# EAGLE design eoncontrol (EAGLE 9.6.2)
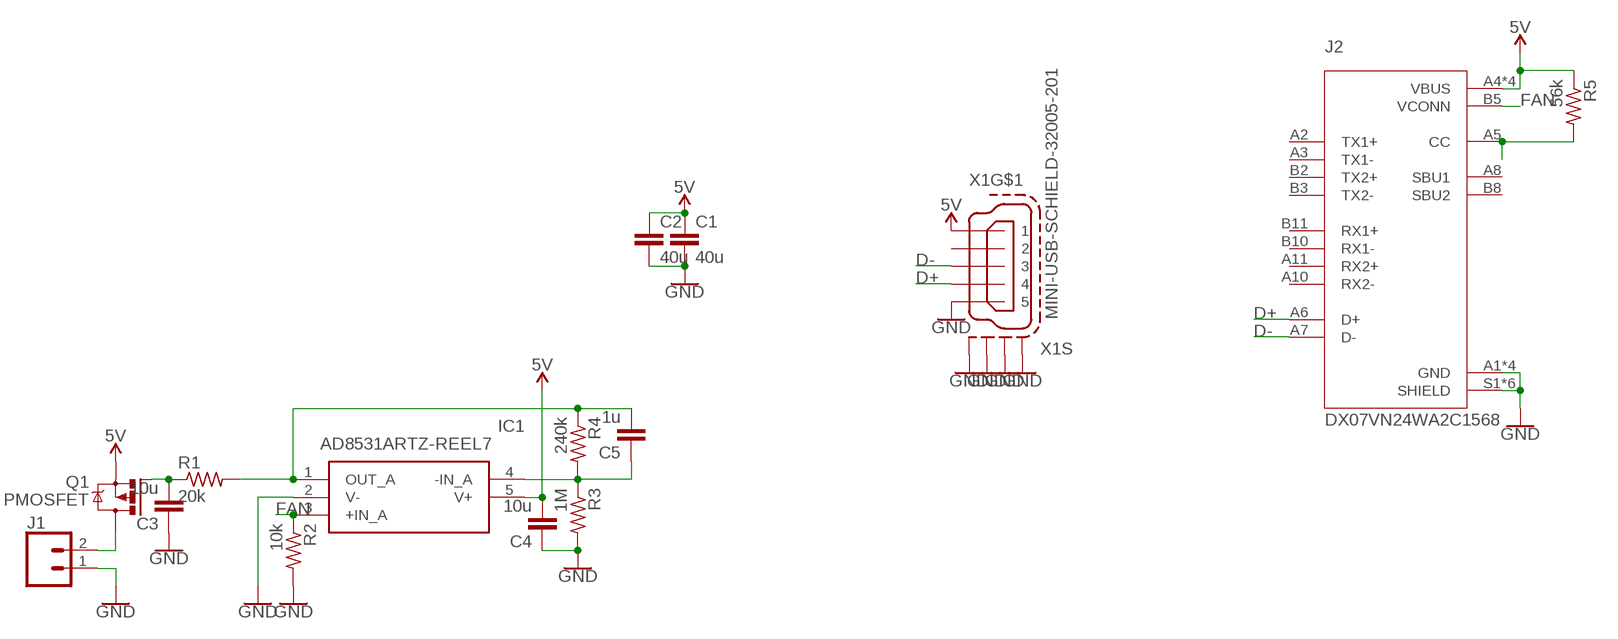
[diagram p0: schematic, sheet 1]

## Parts
C1  40u  C-EUC1206  [C1206]
C2  40u  C-EUC1206  [C1206]
C3  10u  C0603  [0603-C]
C4  10u  C0603  [0603-C]
C5  1u  C0603  [0603-C]
IC1  AD8531ARTZ-REEL7  [SOT95P280X145-5N]
J1  CONN_02  [1X02]
J2  DX07VN24WA2C1568  [JAE_DX07VN24WA2C1568]
Q1  PMOSFET  PMOSFET_SOT23  [SOT23]
R1  20k  R0603  [0603-R]
R2  10k  R0603  [0603-R]
R3  1M  R0603  [0603-R]
R4  240k  R0603  [0603-R]
R5  56k  R0603  [0603-R]
X1  MINI-USB-SCHIELD-32005-201  [32005-201]

## Nets
5V: C1.1 C2.1 C4.2 IC1.5(V+) J2.A4(VBUS) J2.A9(VBUS) J2.B4(VBUS) J2.B9(VBUS) Q1.2(S) R5.1 X1.1
D+: J2.A6(D+) X1.4
D-: J2.A7(D-) X1.3
FAN: IC1.3(+IN_A) J2.B5(VCONN) R2.1
GND: C1.2 C2.2 C3.1 C4.1 IC1.2(V-) J1.1 J2.A1(GND) J2.A12(GND) J2.B1(GND) J2.B12(GND) J2.S1(SHIELD) J2.S2(SHIELD) J2.S3(SHIELD) J2.S4(SHIELD) J2.S5(SHIELD) J2.S6(SHIELD) R2.2 R3.2 X1.5 X1.M1(S:S1) X1.M2(S:S2) X1.M3(S:S3) X1.M4(S:S4)
N$1: C3.2 Q1.1(G) R1.1
N$2: J1.2 Q1.3(D)
N$3: C5.1 IC1.4(-IN_A) R3.1 R4.2
N$4: C5.2 IC1.1(OUT_A) R1.2 R4.1
N$5: J2.A5(CC) R5.2
Unconnected: J2.A2(TX1+) J2.A3(TX1-) J2.A8(SBU1) J2.A10(RX2-) J2.A11(RX2+) J2.B2(TX2+) J2.B3(TX2-) J2.B8(SBU2) J2.B10(RX1-) J2.B11(RX1+) X1.2

## Library data of the parts
C1 C2 = rcl:C-EU: CAPACITOR, European symbol; SPICEPREFIX: C
C3-C5 = comma.ai:C
IC1 = SamacSys_Parts:AD8531ARTZ-REEL7: Low Cost, 250 mA Output, Single-Supply Amplifiers Source: Datasheet; DESCRIPTION: Low Cost, 250 mA Output, Single-Supply Amplifiers; HEIGHT: 1.45mm; MANUFACTURER_NAME: Analog Devices; MANUFACTURER_PART_NUMBER: AD8531ARTZ-REEL7; MOUSER_PART_NUMBER: 584-AD8531ARTZ-R7; MOUSER_PRICE-STOCK: https://www.mouser.co.uk/ProductDetail/Analog-Devices/AD8531ARTZ-REEL7?qs=%2FtpEQrCGXCznF5XgXexEPw%3D%3D
J1 = SparkFun-Connectors:CONN_02: Multi connection point. Often used as Generic Header-pin footprint for 0.1 inch spaced/style header connections On any of the 0.1 inch spaced packages, you can populate with these: Break Away Headers - Straight <https://www.sparkfun.com/products/116> (PRT-00116) Break Away Male Headers - Right Angle <https://www.sparkfun.com/products/553> (PRT-00553) Female Headers <https://www.sparkfun.com/products/115> (PRT-00115) Break Away Headers - Machine Pin <https://www.sparkfun.com/products/117> (PRT-00117) Break Away Female Headers - Swiss Machine Pin <https://www.sparkfun.com/products/743> (PRT-00743) For SCREWTERMINALS and SPRING TERMINALS visit here: Screw Terimnals on SparkFun.com <https://www.sparkfun.com/search/results?term=Screw+Terminals> (5mm/3.5mm/2.54mm spacing) This device is also useful as a general connection point to wire up your design to another part of your project. Our various solder wires solder well into these plated through hole pads. Hook-Up Wire - Assortment (Stranded, 22 AWG) <https://www.sparkfun.com/products/11375> (PRT-11375) Hook-Up Wire - Assortment (Solid Core, 22 AWG) <https://www.sparkfun.com/products/11367> (PRT-11367) View the entire wire category on our website here <https://www.sparkfun.com/categories/141> Special notes: Molex polarized connector foot print use with: PRT-08233 with associated crimp pins and housings. 2.54_SCREWTERM for use with PRT-10571. 3.5mm Screw Terminal footprints for PRT-08084 5mm Screw Terminal footprints for use with PRT-08432
J2 = DX07VN24WA2C1568:DX07VN24WA2C1568: CONN PLUG USB3.1 TYPEC 24POS SMD Check prices <https://pricing.snapeda.com/parts/DX07VN24WA2C1568/JAE%20Electronics/view-part?ref=eda>; AVAILABILITY: Warning; DESCRIPTION: USB-C (USB TYPE-C) USB 3.2 Gen 2 (USB 3.1 Gen 2, Superspeed + (USB 3.1)) Plug Connector 24 Position Surface Mount; MF: JAE Electronics; MP: DX07VN24WA2C1568; PACKAGE: None; PRICE: None; PURCHASE-URL: https://pricing.snapeda.com/search/part/DX07VN24WA2C1568/?ref=eda
Q1 = Transistor:PMOSFET: P-Channel MOSFET - Generic; CATEGORY: Transistor; SUB-CATEGORY: MOSFET; TYPE: P-Channel
R1-R5 = comma.ai:R
X1 = con-cypressindustries:MINI-USB-SCHIELD-: MINI USB-B Conector Source: www.cypressindustries.com; OC_FARNELL: unknown; OC_NEWARK: unknown

## Board
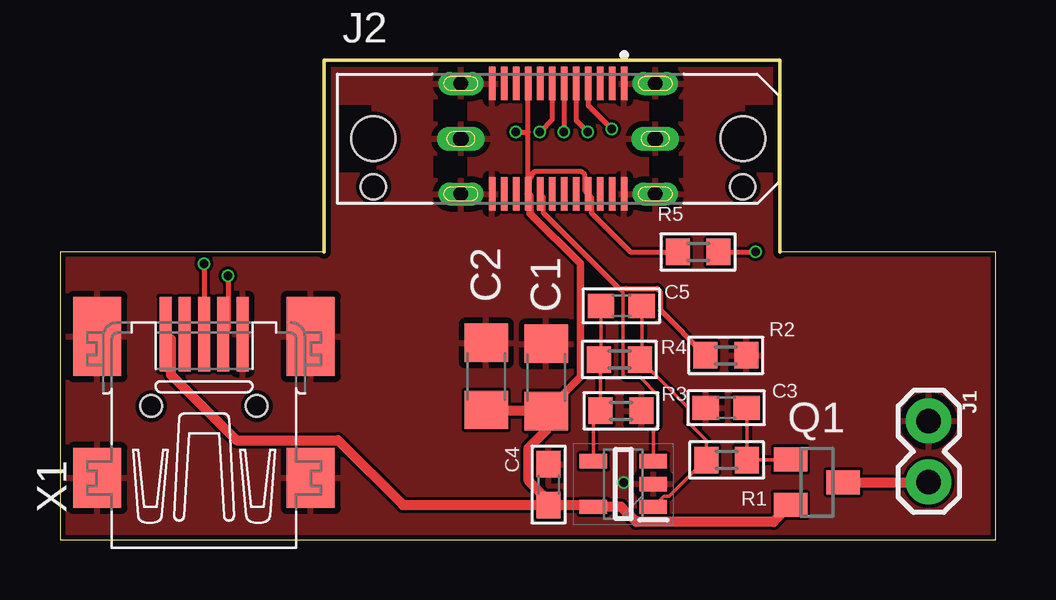
[diagram p1: board, top side]
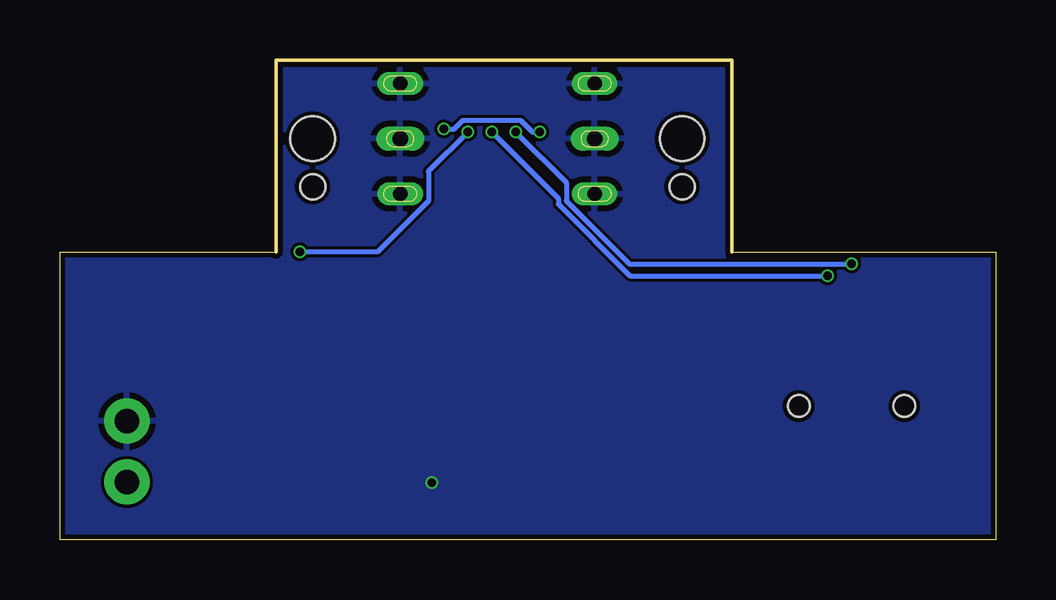
[diagram p2: board, bottom side, seen from below]

Size 39 x 20 mm. Coordinates in mm from the lower left corner, seen from the top.
Outline: 0,0 39,0 39,12 30,12 30,20 11,20 11,12 0,12 0,0
Copper layers (1*16): Top 0.035559375mm / dielectric 1.6mm / Bottom 0.035559375mm
Design rules "jlcpcb2layer": minimum track width 5mil, minimum drill 12mil, track to track 5mil, track to pad 5mil, pad to pad 5mil, via to via 5mil, smd to smd 5mil, copper to edge 8mil, drill to drill 6mil, minimum pad ring 5mil, minimum via ring 3mil, stop-mask expansion 2.5mil, vias tented up to drill 0mil, thermal gap 10mil

### Footprints (pad centres in the part's own frame; a part is rotated, then mirrored left to right if it is on the bottom)
C1206 = smd 1.6 x 1.8: 1 -1.4,0; 2 1.4,0
0603-C = smd 1.1 x 1: 1 -0.85,0; 2 0.85,0
SOT95P280X145-5N = smd 1.15 x 0.6: 1 -1.25,0.95; 2 -1.25,0; 3 -1.25,-0.95; 4 1.25,-0.95; 5 1.25,0.95
1X02 = drill 1.016 pad 1.88: 1 0,0; 2 2.54,0
JAE_DX07VN24WA2C1568 = smd 0.27 x 1.4: A1 2.75,2.3; A2 2.25,2.3; A3 1.75,2.3; A4 1.25,2.3; A5 0.75,2.3; A6 0.25,2.3; A7 -0.25,2.3; A8 -0.75,2.3; A9 -1.25,2.3; A10 -1.75,2.3; A11 -2.25,2.3; A12 -2.75,2.3; B1 -2.75,-2.3; B2 -2.25,-2.3; B3 -1.75,-2.3; B4 -1.25,-2.3; B5 -0.75,-2.3; B6 -0.25,-2.3; B7 0.25,-2.3; B8 0.75,-2.3; B9 1.25,-2.3; B10 1.75,-2.3; B11 2.25,-2.3; B12 2.75,-2.3 | drill 0.6 pad 0.95 long: S1 -4.05,2.3; S2 4.05,2.3; S5 -4.05,-2.3; S6 4.05,-2.3 | drill 0.65 pad 1 long: S3 -4.05,0; S4 4.05,0 | hole 1.85: -7.7,0; 7.7,0 | hole 1.05: -7.7,-2; 7.7,-2
SOT23 = smd 1 x 1.4: 1 -0.95,-1.1; 2 0.95,-1.1; 3 0,1.1
0603-R = smd 1 x 1.1: 1 -0.85,0; 2 0.85,0
32005-201 = smd 3.1 x 0.5: 1 3,1.6; 2 3,0.8; 3 3,0; 4 3,-0.8; 5 3,-1.6 | smd 2.5 x 2: M1 -3,-4.45; M2 -3,4.45 | smd 3.3 x 2: M3 2.9,4.45; M4 2.9,-4.45 | hole 0.9: 0,2.2; 0,-2.2

### Placement (x,y rotation side)
C1  20.27,6.76 90 top
C2  17.77,6.8 90 top
C3  27.77,5.5 0 top
C4  20.37,2.29 270 top
C5  23.4,9.74 0 top
IC1  23.48,2.31 180 top
J1  36.21,4.94 270 top
J2  20.77,16.71 0 top
Q1  31.55,2.39 270 top
R1  27.79,3.31 180 top
R2  27.75,7.68 0 top
R3  23.39,5.37 0 top
R4  23.32,7.5 180 top
R5  26.6,11.99 0 top
X1  6,5.57 90 top

### Tracks (layer width: path | path; a pad name or v marks a point on that pad's centre or on a via)
5V  (via drill 0.35)
  Top 0.2: J2.B4 19.52,15 | 19.52,15 19.52,17 | 19.52,17 J2.A9 | 19.52,15 19.65,15.14 19.65,15.21 19.79,15.34 21.74,15.34 21.88,15.21 21.88,14.55 J2.B9 22.15,14.28 22.15,13.62 23.78,11.99 R5.1 | J2.A4 22.02,18.11 v23,17.12 | v19,17 19.52,17
  Top 0.305: C1.1 21.69,6.78 21.69,11.51 19.6,13.6 19.6,14.33 J2.B4
  Top 0.406: Q1.2 29.75,0.73 24.02,0.73 23.39,1.36 IC1.5 22.16,1.44 C4.2 | C2.1 17.82,5.36 C1.1 20.27,4.56 19.54,3.83 19.54,2.45 20.37,1.62 C4.2 | X1.1 4.62,8.35 4.62,6.88 7.36,4.14 11.59,4.14 14.3,1.44 C4.2
  Bottom 0.2: v19,17 19.31,17 19.8,17.49 22.2,17.49 22.57,17.12 v23,17.12
D+  (via drill 0.35)
  Top 0.2: J2.A6 21.02,17.02 v21,17 | v7,11 7,8.76 X1.4
  Bottom 0.2: v21,17 18.22,14.22 18.22,13.99 15.23,11 v7,11
D-  (via drill 0.35)
  Top 0.2: J2.A7 20.52,17.51 v20,17 | v6,11.5 v6,11.49 X1.3
  Bottom 0.2: v20,17 17.89,14.89 17.89,14.12 15.27,11.5 v6,11.5
FAN
  Top 0.15: IC1.3 24.73,4.53 24.94,4.74 24.94,6 24.19,6.75 23.59,6.75 23.47,6.87 23.47,10.31 23.31,10.46
  Top 0.2: J2.B5 20.15,14.28 20.15,13.62 23.31,10.46 23.6,10.46 23.61,10.47 24.89,10.47 25.03,10.34 25.03,9.56 R2.1
GND  (via drill 0.35)
  other vias: 23.5,2.38
  pour Top: 0,0 0,12 11,12 11,20 30,20 30,12 39,12 39,0
  pour Bottom: 0,0 0,12 11,12 11,20 30,20 30,12 39,12 39,0
N$1
  Top 0.152: C3.2 28.64,5.47 R1.1 30.43,3.31 Q1.1
N$2
  Top 0.406: Q1.3 J1.2
N$3
  Top 0.152: IC1.4 22.23,5.07 R3.1 22.54,7.44 R4.2 22.55,7.58 C5.1
N$4
  Top 0.152: IC1.1 25.18,1.81 25.39,1.81 26.9,3.31 R1.2 26.94,4.14 26.17,4.91 26.17,5.51 R4.1 24.25,7.58 C5.2
N$5  (via drill 0.35)
  Top 0.2: J2.A5 21.52,17.48 v22,17 | R5.2 v29,12
  Bottom 0.2: v22,17 23.64,15.36 23.64,14.12 25.76,12 v29,12